# Altium schematic sheet jack driver 2.SchDoc
size A4; SheetNumber: 8; SheetTotal: 9
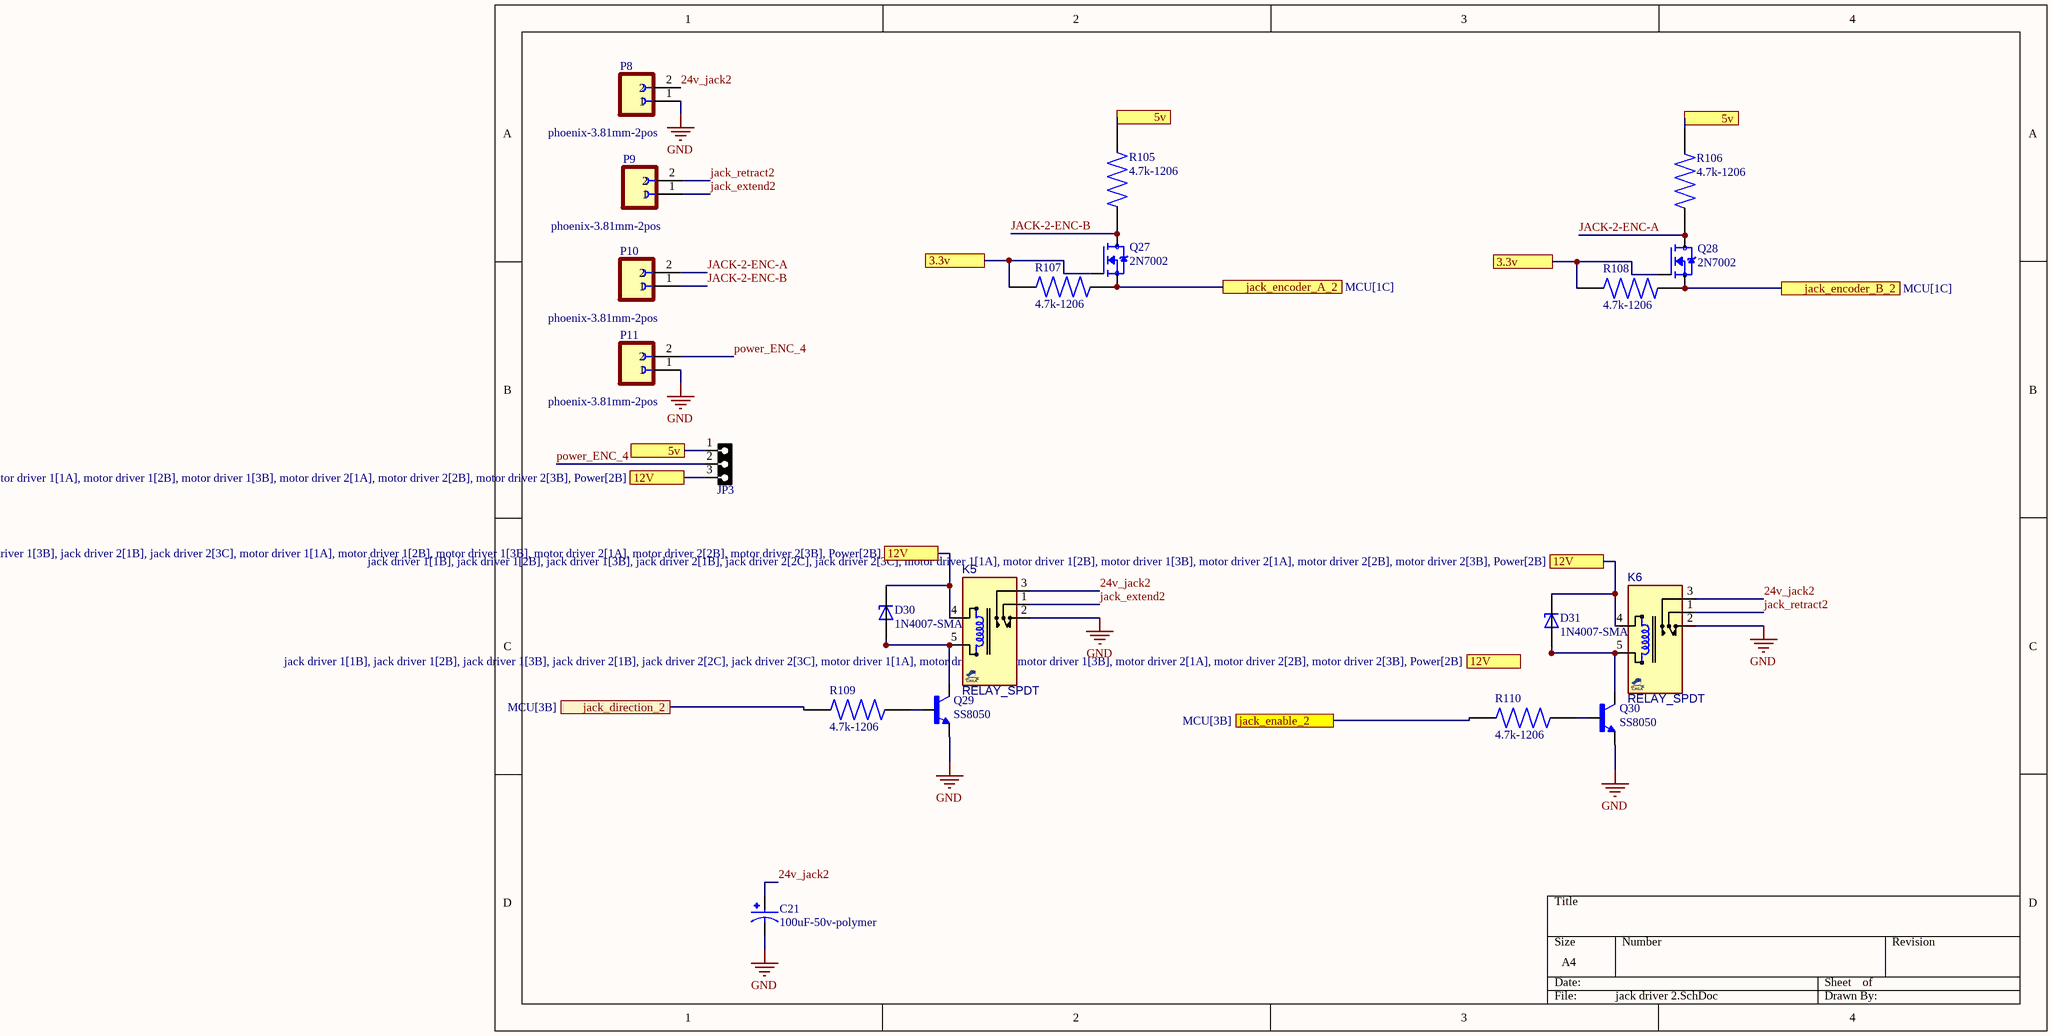
[diagram p0: jack driver 2.SchDoc]

## Parts
C21  100uF-50v-polymer  [CAP_EEEFN1H101L]
D30  1N4007-SMA  [DIOM4325X250N]
D31  1N4007-SMA  [DIOM4325X250N]
JP3  HDRF3  [HDRLP_F_1X3]  (value not drawn)
K5  RELAY_SPDT  [REL_SPDT_5_1512]
K6  RELAY_SPDT  [REL_SPDT_5_1512]
P8  phoenix-3.81mm-2pos  [PHOENIX_1803578]
P9  phoenix-3.81mm-2pos  [PHOENIX_1803578]
P10  phoenix-3.81mm-2pos  [PHOENIX_1803578]
P11  phoenix-3.81mm-2pos  [PHOENIX_1803578]
Q27  2N7002  [SOT95P240X111-3N]
Q28  2N7002  [SOT95P240X111-3N]
Q29  SS8050  [TRANS_SS8050-G]
Q30  SS8050  [TRANS_SS8050-G]
R105  4.7k-1206  [RESC3015X65N]
R106  4.7k-1206  [RESC3015X65N]
R107  4.7k-1206  [RESC3015X65N]
R108  4.7k-1206  [RESC3015X65N]
R109  4.7k-1206  [RESC3015X65N]
R110  4.7k-1206  [RESC3015X65N]

## Ports
3.3v (see interface[1D], interface[3C], jack driver 1[2A], jack driver 1[3B], jack driver 2[2A], motor driver 1[2B], motor driver 1[3B], motor driver 2[2B], motor driver 2[3B], Power[2D], receiver 1[2A], receiver 1[2C], receiver 1[4A], receiver 1[4C], receiver 2[2A], receiver 2[2C], receiver 2[4A], receiver 2[4C]), 3.3v (see interface[1D], interface[3C], jack driver 1[2A], jack driver 1[3B], jack driver 2[3B], motor driver 1[2B], motor driver 1[3B], motor driver 2[2B], motor driver 2[3B], Power[2D], receiver 1[2A], receiver 1[2C], receiver 1[4A], receiver 1[4C], receiver 2[2A], receiver 2[2C], receiver 2[4A], receiver 2[4C]), 5v (see interface[1A], interface[1B], interface[1D], interface[2A], interface[2B], interface[2D], interface[3A], interface[3B], interface[4A], interface[4B], jack driver 1[1B], jack driver 1[2A], jack driver 1[4A], jack driver 2[1B], jack driver 2[2A], MCU[1A], motor driver 1[1A], motor driver 1[2A], motor driver 1[4A], motor driver 2[1A], motor driver 2[2A], motor driver 2[4A], Power[2C]), 5v (see interface[1A], interface[1B], interface[1D], interface[2A], interface[2B], interface[2D], interface[3A], interface[3B], interface[4A], interface[4B], jack driver 1[1B], jack driver 1[2A], jack driver 1[4A], jack driver 2[1B], jack driver 2[4A], MCU[1A], motor driver 1[1A], motor driver 1[2A], motor driver 1[4A], motor driver 2[1A], motor driver 2[2A], motor driver 2[4A], Power[2C]), 5v (see interface[1A], interface[1B], interface[1D], interface[2A], interface[2B], interface[2D], interface[3A], interface[3B], interface[4A], interface[4B], jack driver 1[1B], jack driver 1[2A], jack driver 1[4A], jack driver 2[2A], jack driver 2[4A], MCU[1A], motor driver 1[1A], motor driver 1[2A], motor driver 1[4A], motor driver 2[1A], motor driver 2[2A], motor driver 2[4A], Power[2C]), 12V (see jack driver 1[1B], jack driver 1[2B], jack driver 1[3B], jack driver 2[1B], jack driver 2[2C], jack driver 2[3C], motor driver 1[1A], motor driver 1[2B], motor driver 1[3B], motor driver 2[1A], motor driver 2[2B], motor driver 2[3B], Power[2B]), 12V (see jack driver 1[1B], jack driver 1[2B], jack driver 1[3B], jack driver 2[1B], jack driver 2[3C], motor driver 1[1A], motor driver 1[2B], motor driver 1[3B], motor driver 2[1A], motor driver 2[2B], motor driver 2[3B], Power[2B]), 12V (see jack driver 1[1B], jack driver 1[2B], jack driver 1[3B], jack driver 2[2C], jack driver 2[3C], motor driver 1[1A], motor driver 1[2B], motor driver 1[3B], motor driver 2[1A], motor driver 2[2B], motor driver 2[3B], Power[2B]), jack_direction_2 (see MCU[3B]), jack_enable_2 (see MCU[3B]), jack_encoder_A_2 (see MCU[1C]), jack_encoder_B_2 (see MCU[1C])

## Nets
GND: C21.2 K5.2(NC) K6.2(NC) P8.1 P11.1 Q29.2(E) Q30.2(E)
3.3v: Q27.1(G) Q28.1(G) R107.2 R108.2 ; port 3.3v
5v: JP3.1 R105.2 R106.2 ; port 5v
12V: D30.C D31.C JP3.3 K5.4(T1) K6.4(T1) ; port 12V
24v_jack2: C21.1 K5.3(NO) K6.3(NO) P8.2
JACK-2-ENC-A: P10.2 Q28.3(D) R106.1
JACK-2-ENC-B: P10.1 Q27.3(D) R105.1
jack_direction_2: R109.2 ; port jack_direction_2
jack_enable_2: R110.2 ; port jack_enable_2
jack_encoder_A_2: Q27.2(S) R107.1 ; port jack_encoder_A_2
jack_encoder_B_2: Q28.2(S) R108.1 ; port jack_encoder_B_2
jack_extend2: K5.1(COM) P9.1
jack_retract2: K6.1(COM) P9.2
power_ENC_4: JP3.2 P11.2
NetD30_A: D30.A K5.5(T2) Q29.3(C)
NetD31_A: D31.A K6.5(T2) Q30.3(C)
NetQ29_1: Q29.1(B) R109.1
NetQ30_1: Q30.1(B) R110.1

## Library data of the parts
C21 = EEEFN1H101L: CAP ALUM 100UF 20% 50V SMD; MF: Panasonic; SnapEDA_Link: https://www.snapeda.com/parts/EEEFN1H101L/Panasonic/view-part/?ref=snap; Package: RADIAL-2 Panasonic; Value: *; MP: EEEFN1H101L; Check_prices: https://www.snapeda.com/parts/EEEFN1H101L/Panasonic/view-part/?ref=eda
D30 D31 = SMAJ26A: 400W, 30.4V, 5%, Unidirectional, TVS; MF: Taiwan Semiconductor; SnapEDA_Link: https://www.snapeda.com/parts/SMAJ26A/taiwan/view-part/?ref=snap; Package: SMA-2 Taiwan Semiconductor; Value: *; MP: SMAJ26A; Check_prices: https://www.snapeda.com/parts/SMAJ26A/taiwan/view-part/?ref=eda
JP3 = HDRLP_F_1X3: CONN, HEADER, Male, pitch: 2.54mm, 3POS; VALUE: HDRF3
K5 K6 = RELAY_SPDT_5_1512_G8QN: Relay, SPDT, 5P, 15.4X12.1mm, 16V/30A; MANF: OMRON; MANF_P#: G8QN-1C4 DC12; PARAM2: 16VDC, 30A; PARAM: 12V, 50mA; PRICE: PRICE; Value: RELAY_SPDT
P8-P11 = 1803578: 2 Position Terminal Block Plug, Female Sockets 0.150 (3.81mm) 180Â° Free Hanging (In-Line); MF: Phoenix Contact; Price: None; Purchase-URL: https://pricing.snapeda.com/search/part/1803578/?ref=eda; Availability: Good; SnapEDA_Link: https://www.snapeda.com/parts/1803578/Phoenix%20Contact/view-part/46882/?ref=snap; MP: 1803578; Value: *; Check_prices: https://www.snapeda.com/parts/1803578/Phoenix%20Contact/view-part/46882/?ref=eda; Package: Custom Package Phoenix Contact
Q27 Q28 = 2N7002: N-Channel 60V 280mA (Ta) 350mW (Ta) Surface Mount SOT-23-3 (TO-236); MF: {'manufacturer': u'onsemi'}; Package: None; Price: None; Value: *; MP: 2N7002; Availability: Unavailable
Q29 Q30 = SS8050-G: Bipolar (BJT) Transistor NPN 25 V 1.5 A 100MHz 300 mW Surface Mount SOT-23-3; MP: SS8050G; MF: Comchip; Digi-Key_Part_Number: 641-1790-2-ND; Check_prices: https://www.snapeda.com/parts/SS8050G/Comchip/view-part/?ref=eda; Package: None; SnapEDA_Link: https://www.snapeda.com/parts/SS8050G/Comchip/view-part/?ref=snap; Value: *
R105-R110 = CPF1206B10KE1: Res Thin Film 1206 10K Ohm 0.1% 1/8W Â±25ppm/Â°C Molded SMD SMD Paper T/R; Power_Rating: .125 W; MF: TE Connectivity; Voltage_Rating: 150 V; Tolerance: .1%; SnapEDA_Link: https://www.snapeda.com/parts/CPF1206B10KE1/TE+Connectivity/view-part/?ref=snap; Package: 1206; Resistance: 10K; Value: *; MP: CPF1206B10KE1; EU_RoHS_Compliance: Compliant; Check_prices: https://www.snapeda.com/parts/CPF1206B10KE1/TE+Connectivity/view-part/?ref=eda